# EAGLE design femtoduinoUSB (EAGLE 6.4)
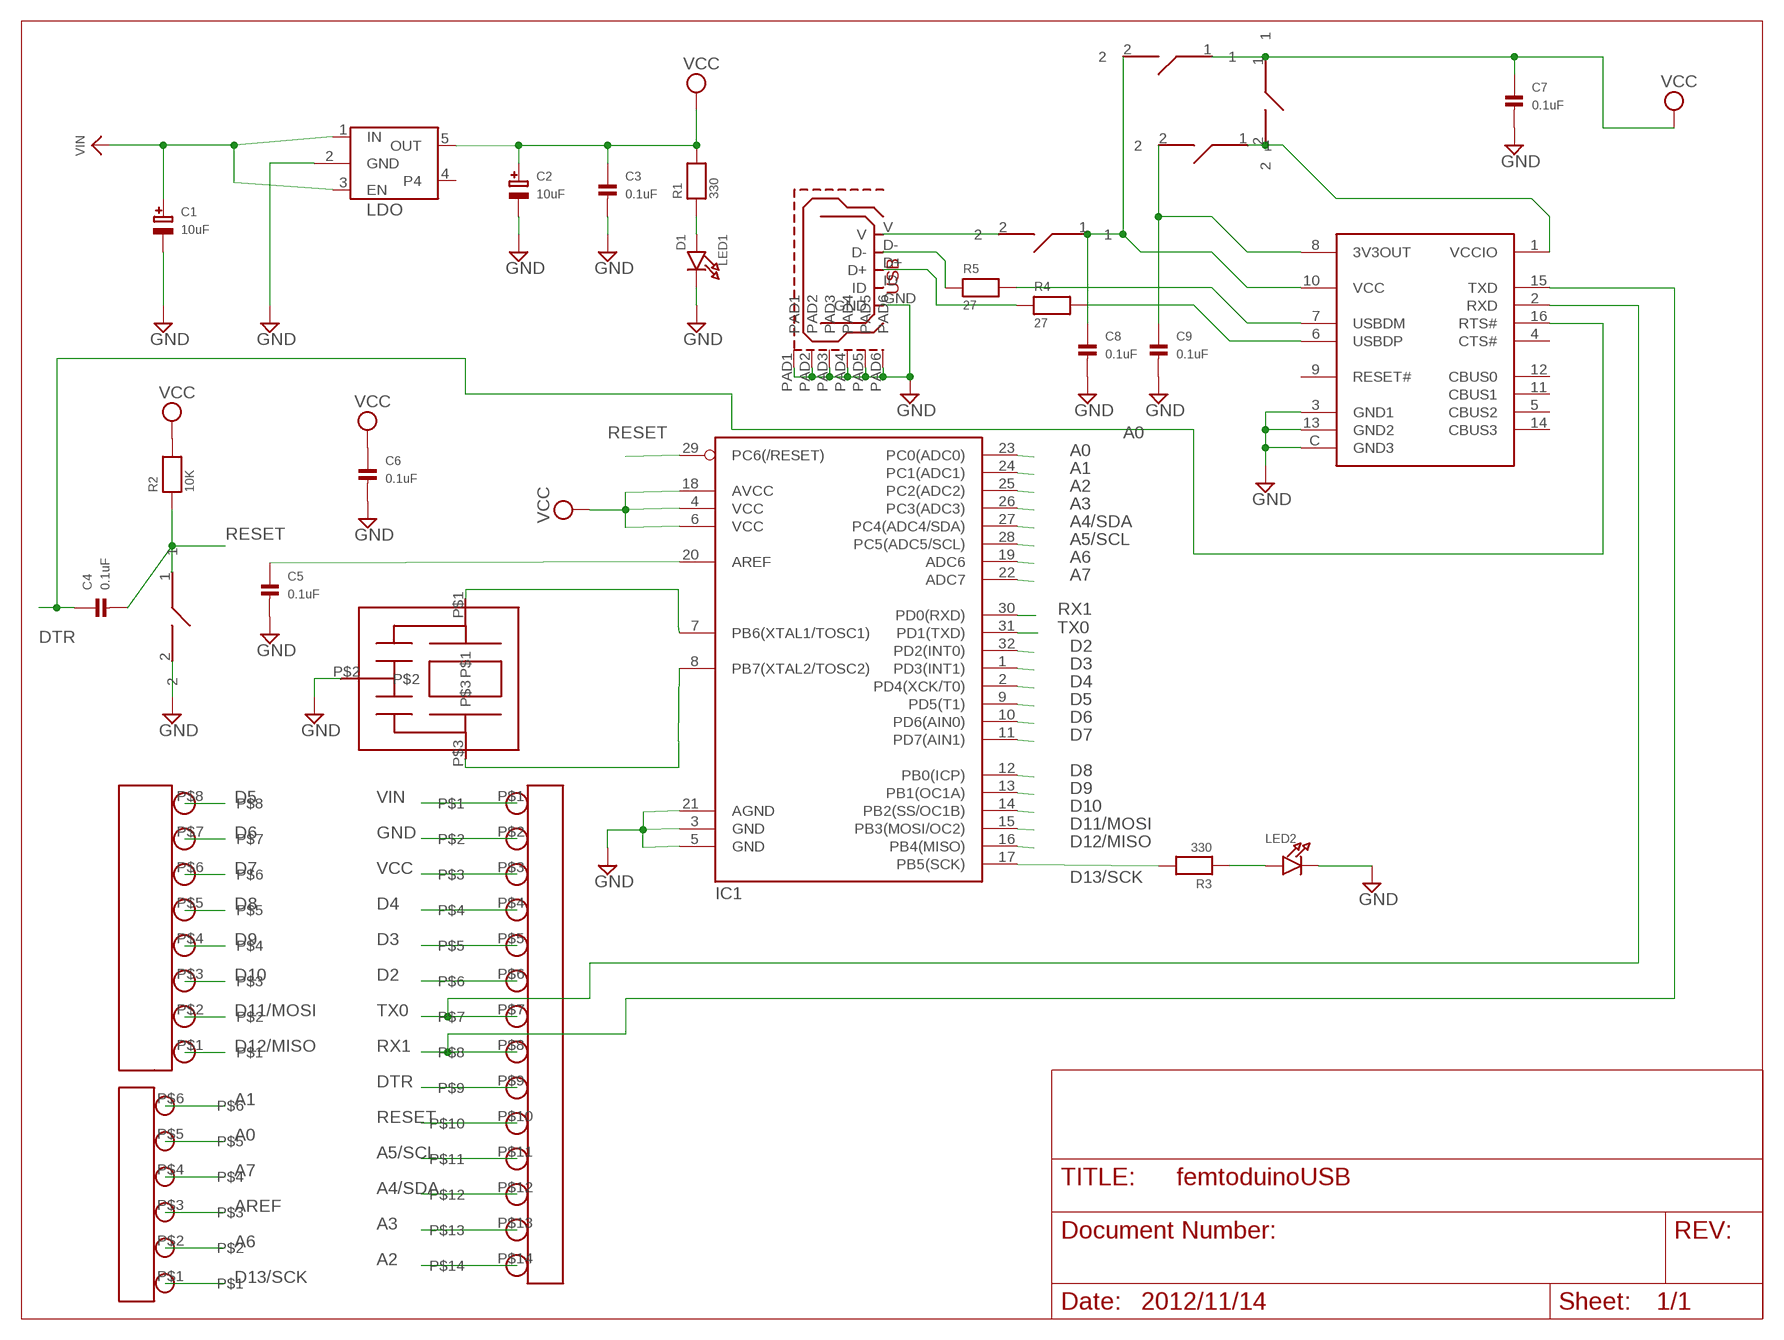
[diagram p0: schematic, sheet 1]
FRAME1 (LETTER_L): LAST_DATE_TIME: 2012/11/14

## Parts
C1  10uF  CAP_TANTALUMB/3528_WAVE  [EIA3528-21/B-W]
C2  10uF  CAP_TANTALUMB/3528_WAVE  [EIA3528-21/B-W]
C3  0.1uF  CAP_CERAMIC0402  [0402]
C4  0.1uF  CAP_CERAMIC0402  [0402]
C5  0.1uF  CAP_CERAMIC0402  [0402]
C6  0.1uF  CAP_CERAMIC0402  [0402]
C7  0.1uF  CAP_CERAMIC0402  [0402]
C8  0.1uF  CAP_CERAMIC0402  [0402]
C9  0.1uF  CAP_CERAMIC0402  [0402]
IC1  ATMEGA168MLF  [MLF32]
LED1  D1  LED0805  [CHIPLED_0805]
LED2  LED0805  [CHIPLED_0805]
R1  330  RESISTOR0402  [0402]
R2  10K  RESISTOR0402  [0402]
R3  330  RESISTOR0402  [0402]
R4  27  RESISTOR0402  [0402]
R5  27  RESISTOR0402  [0402]
SJ1  SPST_SMD  [SPST_SMD]
SJ2  SPST_SMD  [SPST_SMD]
SJ3  SPST_SMD  [SPST_SMD]
SJ4  SPST_SMD  [SPST_SMD]
U1  MIC5205  LDO_REGULATOR  [LDO_REGULATOR]
U$2  05_PINHEAD_1X6  [05_PINHEAD_1X6_PACKAGE]
U$3  05_PINHEAD_1X8  [05_PINHEAD_1X8_PACKAGE]
U$4  05_PINHEAD_1X14  [05_PINHEAD_1X14_PACKAGE]
U$5  CSTCE16MOV51-RO  [CSTCE16M0V51-RO_PACKAGE]
U$6  SPST_SMD  [SPST_SMD]
U$7  FT230XQ  [FT230XQ]
USB1  USB_MICROB  [USB_MICROB_PACKAGE]

## Nets
3V3OUT: C9.1 SJ4.2 U$7.8(3V3OUT)
A0: IC1.23(PC0(ADC0)) U$2.P$5
A1: IC1.24(PC1(ADC1)) U$2.P$6
A2: IC1.25(PC2(ADC2)) U$4.P$14
A3: IC1.26(PC3(ADC3)) U$4.P$13
A4/SDA: IC1.27(PC4(ADC4/SDA)) U$4.P$12
A5/SCL: IC1.28(PC5(ADC5/SCL)) U$4.P$11
A6: IC1.19(ADC6) U$2.P$2
A7: IC1.22(ADC7) U$2.P$4
AREF: C5.1 IC1.20(AREF) U$2.P$3
D2: IC1.32(PD2(INT0)) U$4.P$6
D3: IC1.1(PD3(INT1)) U$4.P$5
D4: IC1.2(PD4(XCK/T0)) U$4.P$4
D5: IC1.9(PD5(T1)) U$3.P$8
D6: IC1.10(PD6(AIN0)) U$3.P$7
D7: IC1.11(PD7(AIN1)) U$3.P$6
D8: IC1.12(PB0(ICP)) U$3.P$5
D9: IC1.13(PB1(OC1A)) U$3.P$4
D10: IC1.14(PB2(SS/OC1B)) U$3.P$3
D11/MOSI: IC1.15(PB3(MOSI/OC2)) U$3.P$2
D12/MISO: IC1.16(PB4(MISO)) U$3.P$1
D13/SCK: IC1.17(PB5(SCK)) R3.2 U$2.P$1
D+: R4.2 U$7.6(USBDP)
D-: R5.2 U$7.7(USBDM)
DTR: C4.1 U$4.P$9 U$7.16(RTS#)
GND: C1.- C2.- C3.2 C5.2 C6.2 C7.2 C8.2 C9.2 IC1.3(GND) IC1.5(GND) IC1.21(AGND) LED1.C LED2.C U1.2(GND) U$4.P$2 U$5.P$2 U$6.2 U$7.3(GND1) U$7.13(GND2) U$7.C(GND3) USB1.GND USB1.PAD1 USB1.PAD2 USB1.PAD3 USB1.PAD4 USB1.PAD5 USB1.PAD6
N$1: R4.1 USB1.D+
N$2: R5.1 USB1.D-
N$5: LED1.A R1.1
N$25: LED2.A R3.1
PB6: IC1.7(PB6(XTAL1/TOSC1)) U$5.P$1
PB7: IC1.8(PB7(XTAL2/TOSC2)) U$5.P$3
RESET: C4.2 IC1.29(PC6(/RESET)) R2.1 U$4.P$10 U$6.1
RX1: IC1.30(PD0(RXD)) U$4.P$8 U$7.15(TXD)
TX0: IC1.31(PD1(TXD)) U$4.P$7 U$7.2(RXD)
V_VCC: C8.1 SJ1.1 SJ2.2 U$7.10(VCC)
VCC: C2.+ C3.1 C6.1 C7.1 IC1.4(VCC) IC1.6(VCC) IC1.18(AVCC) R1.2 R2.2 SJ1.2 SJ2.1 SJ3.1 U1.5(OUT) U$4.P$3 USB1.V
VCCIO: SJ3.2 SJ4.1 U$7.1(VCCIO)
VIN: C1.+ U1.1(IN) U1.3(EN) U$4.P$1
Unconnected: U1.4 U$7.4(CTS#) U$7.5(CBUS2) U$7.9(RESET#) U$7.11(CBUS1) U$7.12(CBUS0) U$7.14(CBUS3) USB1.ID

## Library data of the parts
C1 C2 = microbuilder:CAP_TANTALUM: Tantalum Capacitors Wave footprints have larger pads and are meant to be used for hand soldering. Reflow footprints are optimised for solder paste and a reflow oven. EIA3216-18/A-[R/W] - Size A / 3216-18 / 1206 footprint 4.7µF 25V 10% Tantalum Capacitor 10µF 16V 10% Tantalum Capacitor [Digikey: 495-2236-2-ND] EIA3528-21/B-[R/W] - Size B / 3528-21 47µF 10V 10% Tantalum Capactior [Digikey: 495-2216-1-ND] EIA6032-28/C-[R/W] - Size C / 6032-28 10µF 35V 20% Tantalum Capacitor [Digikey: 495-2285-1-ND] 100µF 16V 10% Tantalum Capactior [Digikey: 399-5214-1-ND]
C3-C9 = microbuilder:CAP_CERAMIC: Ceramic Capacitors 0402 - 0402 Surface Mount Capacitors 16pF 50V 5% [Digikey: 445-4899-2-ND] 18pF 50V 5% [Digikey: 490-1281-2-ND] 22pF 50V 5% [Digikey: 490-1283-2-ND] 68pF 50V 5% [Digikey: 490-1289-2-ND] 0.1uF 10V 10% [Digikey: 490-1318-2-ND] 1.0uF 6.3V 10% [Digikey: 490-1320-2-ND] 0603 - 0603 Surface Mount Capacitors 16 pF 50V 5% [Digikey: 445-5051-2-ND] 22 pF 50V [Digikey: PCC220ACVTR-ND] 33 pF 50V 5% [Digikey: 490-1415-1-ND] 56pF 50V 5% [Digikey: 490-1421-1-ND] 220pF 50V 5% [Digikey: 445-1285-1-ND] 680 pF 50V 2200 pF 50V 5% C0G [Digikey: 445-1297-1-ND] 5600 pF 100V 5% X7R [Digikey: 478-3711-1-ND] 0.1 µF 25V 10% [Digikey: PCC2277TR-ND] 0.22 µF 16V 10% X7R [Digikey: 445-1318-1-ND] 1.0 µF 25V 10% [Digikey: 445-5146-2-ND] 0603 - RF Specific 3pF 250V +/-0.1pF RF [Digikey: 712-1347-1-ND] 18 pF 250V 5% [Digikey: 478-3505-1-ND or 712-1322-1-ND] 56 pF 250V 5% C0G RF [Digikey: 490-4867-1-ND] 68 pF 250V RF [Digikey: 490-4868-1-ND] 0805 - 0805 Surface Mount Capacitors 220 pF 250V 2% RF Ceramic Capacitor [Digikey: 712-1398-1-ND] 1000 pF 50V 2% NP0 Ceramic Capacitor [Digikey: 478-3760-1-ND] 0.1 µF 25V 10% Ceramic Capacitor [Digikey: PCC1828TR-ND] 1.0 µF 16V 10% Ceramic Capacitor[Digikey: 490-1691-2-ND] 10.0 µF 10V 10% Ceramic Capacitor[Digikey: 709-1228-1-ND] 10.0 uF 16V 10% Ceramic Capacitor [Digikey: 478-5165-2-ND] 47 uF 6.3V 20% Ceramic Capacitor [Digikey: 587-1779-1-ND or 399-5506-1-ND] 1206 - 1206 Surface Mount Capacitors 47uF 10V 20% Ceramic Capacitor [Digikey: 490-5528-1-ND or 399-5508-1-ND or 445-6010-1-ND] 100uF 6.3V -20%, +80% Y5V Ceramic Capacitor (Digikey: 490-4512-1-ND, Mouser: 81-GRM31CF50J107ZE1L)
IC1 = SparkFun-DigitalIC:ATMEGA168: Atmel 32-pin 8-bit micro, 16k flash.
LED1 LED2 = microbuilder:LED: LED 0603 - 0603 Surface Mount Package 2mA: Green LED - Low Power (3.9mcd, 2ma, 1.7Vf) - Digikey: 475-2709-2-ND Orange LED - Low Power (9.8mcd, 2ma, 1.8Vf) - Digikey: 475-1194-2-ND Red LED - Low Power (5mcd, 2ma, 1.8Vf) - Digikey: 475-1195-2-ND Yellow LED - Low Power (7mcd, 2ma, 1.8Vf) - Digikey: 475-1196-2-ND 5mA: Blue LED - Low Power (17mcd, 5ma, 2.9Vf) - Digikey: LNJ937W8CRACT-ND 0805 - 0805 Surface Mount Package 2mA: Red LED (8.8mcd, 2mA, 1.8Vf, Clear) - Low Power [Digikey: 475-2510-1-ND] Green LED (5mcd, 2mA, 1.8Vf, Clear) - Low Power [Digikey: 475-2730-1-ND] Yellow LED (11.3mcd, 2mA, 1.8Vf, Clear) - Low Power [Digikey: 475-2555-1-ND] 20mA: Red LED (104mcd, 20mA, Diffused) - LS R976 [Digikey: 475-1278-6-ND] Red LED (12mcd, 20mA, 2.0Vf, Clear) - APT2012EC [Digikey: 754-1128-1-ND] Green LED (15mcd, 20mA, 2.2Vf, Clear) - APT2012GC [Digikey: 754-1131-1-ND] Orange LED (160mcd, 20mA, 2.1Vf, Clear) - APT2012SECK [Digikey: 754-1130-1-ND] 1206 - 1206 Surface Mount Package Green LED (26mcd, 20mA, Diffused) - LG N971 [Digikey: 475-1407-6-ND] Red LED (15mcd, 20mA, Diffused) - LH N974 [Digikey: 475-1416-6-ND]
R1-R5 = microbuilder:RESISTOR: Resistors 0402 - 0402 Surface Mount Package 22 Ohm 1% 1/16W [Digikey: 311-22.0LRTR-ND] 33 Ohm 5% 1/16W 1.0K 5% 1/16W 1.5K 5% 1/16W 2.0K 1% 1/16W 10.0K 1% 1/16W [Digikey: 311-10.0KLRTR-ND] 10.0K 5% 1/16W [Digikey: RMCF0402JT10K0TR-ND] 12.1K 1% 1/16W [Digikey: 311-22.0LRTR-ND] 100.0K 5% 1/16W 0603 - 0603 Surface Mount Package 0 Ohm 1/10 Watt 1% Resistor 15 Ohm 1/10 Watt 1% Resistor 33 Ohm 1/10 Watt 1% Resistor 49.9 Ohm 1/10 Watt 1% Resistor 100 Ohm 1/10 Watt 1% Resistor 150 Ohm 1/10 Watt 1% Resistor 240 Ohm 1/10 Watt 1% Resistor 390 Ohm 1/10 Watt 1% Resistor 560 Ohm 1/10 Watt 1% Resistor 680 Ohm 1/10 Watt 1% Resistor 750 Ohm 1/10 Watt 1% Resistor 1.0K Ohm 1/10 Watt 1% Resistor 1.5K Ohm 1/10 Watt 1% Resistor 2.0K Ohm 1/10 Watt 1% Resistor 2.2K Ohm 1/10 Watt 1% Resistor 3.3K Ohm 1/10 Watt 1% Resistor 4.7K Ohm 1/10 Watt 1% Resistor 10.0K Ohm 1/10 Watt 1% Resistor 12.0K Ohm 1/10 Watt 1% Resistor 12.1K Ohm 1/10 Watt 1% Resistor 20.0K Ohm 1/10 Watt 1% Resistor 33.0K Ohm 1/10 Watt 1% Resistor 100.0K Ohm 1/10 Watt 1% Resistor 0805 - 0805 Surface Mount Package 0 Ohm 1/8 Watt 1% Resistor 33 Ohm 1/8 Watt 1% Resistor 100 Ohm 1/8 Watt 1% Resistor 150 Ohm 1/8 Watt 1% Resistor 200 Ohm 1/8 Watt 1% Resistor 240 Ohm 1/8 Watt 1% Resistor 330 Ohm 1/8 Watt 1% Resistor 390 Ohm 1/8 Watt 1% Resistor 470 Ohm 1/8 Watt 1% Resistor 1.0K Ohm 1/8 Watt 1% Resistor 1.5K Ohm 1/8 Watt 1% Resistor 2.0K Ohm 1/8 Watt 1% Resistor 4.7K Ohm 1/8 Watt 1% Resistor 5.1K Ohm 1/8 Watt 1% Resistor 5.6K Ohm 1/8 Watt 1% Resistor 10.0K Ohm 1/8 Watt 1% Resistor 22.0K Ohm 1/8 Watt 1% Resistor 33.0K Ohm 1/8 Watt 1% Resistor 100K Ohm 1/8 Watt 1% Resistor 1206 - 1206 Surface Mount Package 2012 - 2010 Surface Mount Package 0.11 Ohm 1/2 Watt 1% Resistor - Digikey: RHM.11UCT-ND
SJ1-SJ4 U$6 = ftdi_ft231xq-r:SPST_SMD
U1 = ftdi_ft231xq-r:LDO_REGULATOR
U$2 = ftdi_ft231xq-r:05_PINHEAD_1X6
U$3 = ftdi_ft231xq-r:05_PINHEAD_1X8
U$4 = ftdi_ft231xq-r:05_PINHEAD_1X14
U$5 = ftdi_ft231xq-r:CSTCE16MOV51-RO: This is the CSTCE16M0V51-R0 Murata resonator (CERALOCK) 16Mhz 0.5% Tolerance
U$7 = ftdi_ft231xq-r:FT230XQ
USB1 = ftdi_ft231xq-r:USB_MICROB: This is the hirose ZX62-B-5PA(11) MICRO-USB B Type female connection.

## Board
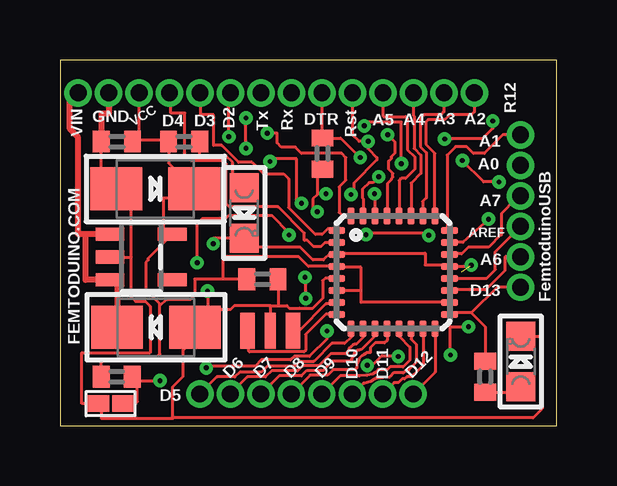
[diagram p1: board, top side]
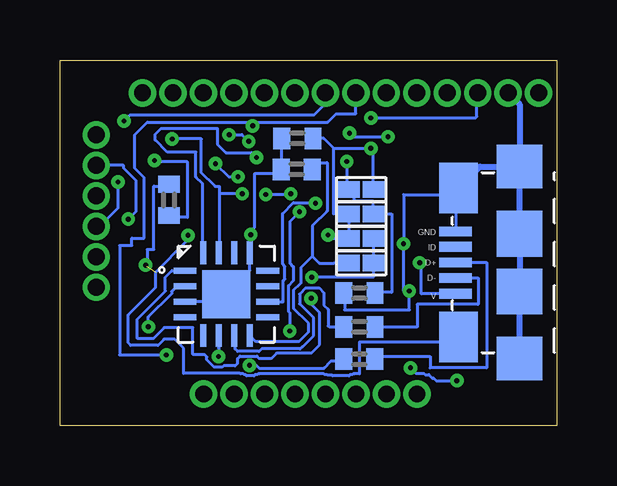
[diagram p2: board, bottom side, seen from below]

Size 20.7 x 15.24 mm. Coordinates in mm from the lower left corner, seen from the top.
Outline: 0,0 20.7,0 20.7,15.24 0,15.24 0,0
Copper layers (1*16): Top 0.0356mm / dielectric 1.5011mm / Bottom 0.0356mm
Design rules "LaenPCBOrder": minimum track width 6mil, minimum drill 13mil, track to track 6mil, track to pad 6mil, pad to pad 6mil, via to via 6mil, smd to smd 6mil, copper to edge 15mil, drill to drill 6mil, minimum pad ring 7mil, minimum via ring 7mil, stop-mask expansion 4mil, vias tented up to drill 0mil, thermal gap 10mil

### Footprints (pad centres in the part's own frame; a part is rotated, then mirrored left to right if it is on the bottom)
EIA3528-21/B-W = smd 2.15 x 1.8: + 1.625,0; - -1.625,0
0402 = smd 0.7 x 0.9: 1 -0.65,0; 2 0.65,0
MLF32 = smd 0.7 x 0.3: 1 -2.35,1.75; 2 -2.35,1.25; 3 -2.35,0.75; 4 -2.35,0.25; 5 -2.35,-0.25; 6 -2.35,-0.75; 7 -2.35,-1.25; 8 -2.35,-1.75; 17 2.35,-1.75; 18 2.35,-1.25; 19 2.35,-0.75; 20 2.35,-0.25; 21 2.35,0.25; 22 2.35,0.75; 23 2.35,1.25; 24 2.35,1.75 | smd 0.3 x 0.7: 9 -1.75,-2.35; 10 -1.25,-2.35; 11 -0.75,-2.35; 12 -0.25,-2.35; 13 0.25,-2.35; 14 0.75,-2.35; 15 1.25,-2.35; 16 1.75,-2.35; 25 1.75,2.35; 26 1.25,2.35; 27 0.75,2.35; 28 0.25,2.35; 29 -0.25,2.35; 30 -0.75,2.35; 31 -1.25,2.35; 32 -1.75,2.35
CHIPLED_0805 = smd 1.2 x 1.2: A 0,-1.05; C 0,1.05
SPST_SMD = smd 0.889 x 0.699: 1 -0.508,0; 2 0.508,0
LDO_REGULATOR = smd 0.55 x 1.2: 1 -0.95,-1.3; 2 0,-1.3; 3 0.95,-1.3; 4 0.95,1.3; 5 -0.95,1.3
05_PINHEAD_1X6_PACKAGE = drill 0.7 pad 1.143: P$1 0,0; P$2 0,1.27; P$3 0,2.54; P$4 0,3.81; P$5 0,5.08; P$6 0,6.35
05_PINHEAD_1X8_PACKAGE = drill 0.7 pad 1.143: P$1 0,0; P$2 0,1.27; P$3 0,2.54; P$4 0,3.81; P$5 0,5.08; P$6 0,6.35; P$7 0,7.62; P$8 0,8.89
05_PINHEAD_1X14_PACKAGE = drill 0.7 pad 1.143: P$1 0,0; P$2 0,1.27; P$3 0,2.54; P$4 0,3.81; P$5 0,5.08; P$6 0,6.35; P$7 0,7.62; P$8 0,8.89; P$9 0,10.16; P$10 0,11.43; P$11 0,12.7; P$12 0,13.97; P$13 0,15.24; P$14 0,16.51
CSTCE16M0V51-RO_PACKAGE = smd 1.5 x 0.62: P$1 0,1.9; P$3 0,0 | smd 1.5 x 0.45: P$2 0,0.95
FT230XQ = smd 0.95 x 0.25: 1 -1.725,0.975; 2 -1.725,0.325; 3 -1.725,-0.325; 4 -1.725,-0.975; 9 1.725,-0.975; 10 1.725,-0.325; 11 1.725,0.325; 12 1.725,0.975 | smd 0.25 x 0.95: 5 -0.975,-1.725; 6 -0.325,-1.725; 7 0.325,-1.725; 8 0.975,-1.725; 13 0.975,1.725; 14 0.325,1.725; 15 -0.325,1.725; 16 -0.975,1.725 | smd 2 x 2: C 0,0
USB_MICROB_PACKAGE = smd 0.4 x 1.35: D+ 0,-0.68; D- -0.64,-0.68; GND 1.3,-0.68; ID 0.66,-0.68; V -1.3,-0.68 | smd 2.1 x 1.6: PAD1 -3.1,-0.8; PAD2 3.1,-0.8 | smd 1.8 x 1.9: PAD3 -4,-3.35; PAD6 4,-3.35 | smd 1.9 x 1.9: PAD4 -1.2,-3.35; PAD5 1.2,-3.35

### Placement (x,y rotation side)
C1  4,4.1 180 top
C2  3.97,9.87 0 top
C3  2.37,11.84 180 top
C4  10.93,11.34 270 top
C5  16.16,9.41 90 bottom
C6  8.44,6.11 0 top
C7  10.81,11.98 180 bottom
C8  8.22,5.53 180 bottom
C9  10.84,10.68 180 bottom
IC1  13.88,6.39 0 top
LED1  7.67,8.87 180 top
LED2  19.2,2.68 0 top
R1  5.17,11.84 180 top
R2  2.36,2.04 180 top
R3  17.72,2.04 90 top
R4  8.23,2.78 180 bottom
R5  8.22,4.12 180 bottom
SJ1  8.15,9.85 0 bottom
SJ2  8.15,8.82 0 bottom
SJ3  8.15,7.8 0 bottom
SJ4  8.15,6.79 180 bottom
U1  3.38,7.03 270 top
U$2  19.19,5.77 0 top
U$3  14.72,1.32 90 top
U$4  0.76,13.87 270 top
U$5  7.81,3.97 270 top
U$6  2.11,0.92 180 top
U$7  13.77,5.49 0 bottom
USB1  4.9,6.8 90 bottom

### Tracks (layer width: path | path; a pad name or v marks a point on that pad's centre or on a via)
3V3OUT
  Bottom 0.127: C9.1 10.24,10.96 9.58,10.96 9.58,8.94 10.19,8.33 10.19,7.07 | SJ4.2 9.28,6.77 9.89,6.77 10.19,7.07 | 10.19,7.07 10.67,6.58 10.67,5.94 10.97,5.64 10.97,4.9 10.34,4.27 10.34,3.91 10.74,3.5 12.54,3.5 U$7.8
A0  (via drill 0.2)
  Top 0.127: v17.86,8.61 16.79,7.64 IC1.23
  Bottom 0.127: U$2.P$5 18.06,10.85 18.06,10.75 17.55,10.24 17.55,8.91 v17.86,8.61
A1
  Top 0.127: U$2.P$6 18.45,12.12 17.68,11.35 17.22,11.35 16.94,11.63 16.48,11.63 16.13,11.28 16.13,8.24 IC1.24
A2
  Top 0.127: U$4.P$14 17.27,13.07 17.14,12.95 16.23,12.95 16.03,12.75 15.34,12.75 15.24,12.65 15.24,11.73 15.62,11.35 IC1.25
A3
  Top 0.127: U$4.P$13 16,13.07 15.88,12.95 15.16,12.95 15.01,12.8 15.01,11.63 15.27,11.38 15.27,9.5 15.11,9.35 15.11,8.76 IC1.26
A4/SDA
  Top 0.127: U$4.P$12 14.73,12.94 14.76,12.9 14.76,11.56 15.04,11.28 15.04,10.52 14.63,10.11 IC1.27
A5/SCL
  Top 0.127: U$4.P$11 13.46,12.91 13.49,12.88 14.4,12.88 14.48,12.8 14.48,11.51 14.78,11.2 14.78,10.69 14.4,10.31 14.22,10.31 14.13,10.22 IC1.28
A6
  Top 0.127: U$2.P$2 18.55,7.04 18.54,7.04 18.54,6.48 17.73,5.66 16.25,5.66 IC1.19
A7
  Top 0.127: U$2.P$4 18.98,9.58 18.98,9.43 18.39,8.84 18.39,7.95 18.36,7.95 17.86,7.44 17.02,7.44 16.74,7.16 16.25,7.16 IC1.22
AREF  (via drill 0.2)
  Top 0.127: v18.29,10.16 17.65,10.16 v16.76,11.05 | IC1.20 17.78,6.14 18.14,6.5 18.14,7.26 U$2.P$3
  Bottom 0.127: v16.76,11.05 16.76,11 15.39,11 15.39,8.69 16.16,8.69 C5.1 | U$2.P$3 19.05,8.31 18.29,9.07 v18.29,10.16
D2  (via drill 0.2)
  Top 0.127: v8.64,12.19 9.04,12.19 9.04,11.79 9.22,11.61 9.8,11.61 10.06,11.35 11.73,11.35 11.91,11.18 11.91,10.24 11.63,9.96 11.63,8.89 11.78,8.74 IC1.32 | v7.04,12.04 7.04,13.8 U$4.P$6
  Bottom 0.127: v8.64,12.19 8.48,12.04 v7.04,12.04
D3
  Top 0.127: U$4.P$5 5.84,12.95 6.4,12.95 6.4,11.68 6.73,11.68 7.44,10.97 8,10.97 8.48,10.49 9.32,10.49 9.53,10.29 9.53,9.09 10.64,7.98 10.92,7.98 11.15,8.21 11.53,8.21 IC1.1
D4
  Top 0.127: U$4.P$4 4.62,13.87 4.62,13.03 5.21,13.03 5.21,11.3 5.46,11.05 6.78,11.05 6.93,10.9 6.93,9.25 7.06,9.12 9.09,9.12 10.19,8.03 10.19,7.72 10.31,7.72 10.57,7.47 10.87,7.47 11.02,7.62 11.21,7.62 11.23,7.64 IC1.2
D5
  Top 0.127: U$3.P$8 6.54,2.03 7.29,2.03 7.49,2.23 8.38,2.23 8.64,2.49 9.78,2.49 9.98,2.69 10.59,2.69 11.33,3.43 11.86,3.43 12.13,3.7 IC1.9
D6
  Top 0.127: U$3.P$7 7.81,2.03 8.56,2.03 8.81,2.29 9.91,2.29 10.13,2.52 10.79,2.52 11.28,3 11.94,3 11.96,3.02 11.96,3.07 12.01,3.12 12.01,3.15 12.04,3.17 12.04,3.23 12.12,3.3 12.14,3.3 12.22,3.38 12.24,3.38 12.27,3.4 12.34,3.4 12.63,3.69 IC1.10
D7
  Top 0.127: U$3.P$6 9.13,2.08 10.06,2.08 10.29,2.31 10.97,2.31 11.35,2.69 12.09,2.69 12.17,2.77 12.17,2.82 12.22,2.87 12.22,2.92 12.24,2.95 12.24,3 12.27,3.02 12.27,3.05 12.34,3.12 12.37,3.12 12.39,3.15 12.47,3.15 12.5,3.17 12.55,3.17 13.13,3.76 IC1.11
D8
  Top 0.127: U$3.P$5 10.42,2.11 11.15,2.11 11.38,2.34 12.29,2.34 12.37,2.41 12.37,2.49 12.37,2.59 12.42,2.69 12.45,2.72 12.45,2.77 12.47,2.79 12.47,2.82 12.57,2.92 12.6,2.92 12.62,2.95 12.65,2.95 12.7,3 12.72,3 12.78,3.05 12.93,3.05 12.93,3.25 13.13,3.45 13.51,3.45 13.63,3.57 IC1.12
D9
  Top 0.127: U$3.P$4 11.67,2.08 12.47,2.08 12.79,2.1 13,2.15 13.11,2.21 13.23,2.31 13.26,2.34 13.64,2.34 13.75,2.45 14.3,2.45 14.58,2.73 14.58,3.28 14.13,3.73 IC1.13
D10
  Top 0.127: IC1.14 14.63,3.61 14.83,3.4 14.83,2.64 14.53,2.34 14.53,2.33 14.5,2.3 14.4,2.3 14.3,2.2 13.9,2.2 13.75,2.05 13.2,2 12.98,1.88 12.64,1.78 U$3.P$3
D11/MOSI
  Top 0.127: IC1.15 15.13,2.53 14.73,2.13 14.65,2.05 14.45,2.05 14.35,1.95 14.25,1.95 14.1,1.8 13.93,1.8 U$3.P$2
D12/MISO
  Top 0.127: IC1.16 15.63,2.23 U$3.P$1
D13/SCK
  Top 0.127: U$2.P$1 18.22,5.77 17.14,4.7 | 17.14,4.7 16.29,4.7 IC1.17 | 17.14,4.7 17.72,4.13 R3.2
D+  (via drill 0.2)
  Top 0.127: v12.8,2.52 13.01,2.52 13.41,2.92 13.98,2.92 v14.1,2.88
  Bottom 0.127: U$7.6 14.09,3.24 v14.1,2.88 | v12.8,2.52 12.52,2.52 12.4,2.4 9.7,2.4 9.4,2.7 8.96,2.7 R4.2
D-
  Bottom 0.127: 8.94,4.19 R5.2 | 9.02,4.27 R5.2 | R5.2 9.48,4.12 9.53,4.17 9.53,4.85 9.7,5.03 9.7,5.54 9.91,5.74 10.46,5.74 10.72,5.49 10.72,5.08 10.13,4.5 10.13,3.76 10.62,3.28 10.7,3.2 12.3,3.2 12.4,3.1 13.3,3.1 13.4,3.2 13.4,3.72 U$7.7
DTR  (via drill 0.2)
  Top 0.127: 10.93,13.87 U$4.P$9 10.92,12.01 C4.1 11.7,11.99 v12.51,11.18
  Bottom 0.127: U$7.16 14.76,7 14.76,10.08 15.04,10.36 15.04,11.4 16.23,11.4 16.74,11.91 16.74,12.14 16.48,12.39 14.15,12.39 14.15,11.73 13.79,11.38 12.71,11.38 v12.51,11.18
GND  (via drill 0.2)  (1 unrouted)
  Top 0.127: 19.23,4 LED2.C 20.09,3.73 20.09,0.71 19.71,0.33 4.7,0.33 | U1.2 2.97,7.03 | 2.97,7.03 2.97,9.47 2.35,9.47 C2.- 1.72,9.87 C3.2 1.8,11.91 | C1.- 6.15,4.1 6.15,4.67 v6.15,5.61 | 11.53,7.19 IC1.3 | 2.97,7.03 2.97,5.36 3.15,5.18 3.56,5.18 3.76,4.98 3.76,3.05 0.91,3.05 0.91,0.93 U$6.2 1.73,0.93 1.73,0.3 4.7,0.3 4.7,0.33 | 7.98,8.13 LED1.C | 11.53,6.2 IC1.5 11.04,6.14 10.95,6.04 10.95,5.31 10.52,4.88 10.01,4.88 9.98,4.9 9.55,4.9 9.45,5 9.09,5 | C1.- 5.62,3.64 5.13,3.15 5.13,2.06 4.7,1.63 4.7,0.33 | 11.53,7.19 15.21,7.19 15.21,6.71 16.23,6.71 IC1.21 17.08,6.64 v17.13,6.69 | 8.76,5 U$5.P$2 | C1.- 6.38,4.85 7.11,4.85 7.26,5 8.76,5 | 8.76,5 9.09,5 | 2.03,13.03 2.01,13.01 | LED1.C 6.39,7.82 v6.39,7.58 | LED1.C 8.08,7.42 8.1,7.44 10.01,7.44 10.54,6.91 10.97,6.91 11.25,7.19 11.53,7.19 | C6.2 9.09,5 | v15.37,7.93 15.37,8.01 12.8,8.01 v12.75,7.96
  Top 0.254: U$4.P$2 2.03,13.03 | 2.01,13.01 1.73,13.01 1.73,12.52 C3.2
  Bottom 0.127: 11.64,10.64 C9.2 | C5.2 16.16,9.98 16.79,9.98 16.79,7.34 17.07,7.34 17.07,6.76 v17.13,6.69 | C8.2 8.84,5.54 8.84,4.83 6.15,4.83 v6.15,5.61 6.39,5.61 v6.39,7.58 6.39,9.63 4.1,9.63 USB1.PAD2 4.22,9.9 USB1.GND | C7.2 11.49,11.8 C9.2 | USB1.PAD1 4.32,3.48 8.23,3.48 8.23,2.16 8.48,2.16 8.51,2.13 8.61,2.13 8.66,2.08 9.35,2.08 9.37,2.11 9.55,2.11 9.58,2.13 9.68,2.13 9.7,2.16 12.45,2.16 12.47,2.13 12.57,2.13 12.62,2.08 12.93,2.08 12.98,2.13 13.03,2.13 13.06,2.16 13.18,2.16 13.21,2.18 15.54,2.18 15.54,3.23 15.93,3.61 16.36,3.61 16.61,3.35 17.75,3.35 17.86,3.45 17.86,4.62 16.71,5.77 16.71,6.4 15.43,7.68 15.43,7.93 v15.37,7.93 | U$7.3 14.09,5.16 U$7.C 12.79,6.46 U$7.13 12.79,7.95 v12.75,7.96 12.8,8.06 12.79,8.06 12.6,8.26 12.6,10.49 12.57,10.52 11.65,10.52 C9.2 | 11.49,10.33 C9.2
  Bottom 0.254: U$4.P$2 1.55,13.39 USB1.PAD6 | USB1.PAD6 USB1.PAD5 USB1.PAD4 USB1.PAD3 | USB1.PAD2 3.2,10.8 USB1.PAD6
N$1
  Bottom 0.127: USB1.D+ 2.92,6.81 2.92,2.41 5.28,2.41 5.28,2.9 7.58,2.9 R4.1 7.58,2.72
N$2
  Bottom 0.127: USB1.D- 3.28,6.16 3.28,5.05 5.82,5.05 5.82,4.12 R5.1
N$5
  Top 0.127: LED1.A 7.19,10.4 7.19,10.97 6.91,11.25 5.82,11.25 R1.1
N$25
  Top 0.127: 18.84,1.57 LED2.A 19.2,1.39 R3.1
PB6
  Top 0.127: U$5.P$1 9.93,3.97 | IC1.7 11.53,5.08 11.07,5.08 9.96,3.97 U$5.P$1 | 9.71,4.28 U$5.P$1 | 9.76,4.01 U$5.P$1
PB7
  Top 0.127: IC1.8 11.07,4.64 10.24,3.81 10.24,3.15 10.16,3.07 7.9,3.07 7.87,3.1 7.87,3.9 U$5.P$3
RESET  (via drill 0.2)
  Top 0.127: 11.18,10.69 C4.2 10.72,10.47 10.72,9.68 | U$4.P$10 12.19,12.12 12.46,11.85 v12.84,11.85 12.84,11.54 13.21,11.18 13.21,11.07 12.24,10.11 12.24,9.75 v12.13,9.64 | v6.1,2.41 6.17,2.49 8.13,2.49 8.38,2.74 9.6,2.74 9.75,2.9 10.39,2.9 11.12,3.63 v11.12,3.95 | v4.17,1.88 3.18,1.88 R2.1 3.23,1.83 3.23,1.02 3.13,0.93 U$6.1 | 13.61,8.73 IC1.29 13.65,8.77 13.65,10.1 13.82,10.26 13.82,10.31 13.87,10.36 13.87,10.52 13.69,10.69 13.69,11.02 13.79,11.12 13.79,11.2 13.95,11.35 13.95,11.84 v13.65,12.13 | v10.72,8.91 10.54,9.09 10.54,9.45 10.72,9.63 10.72,9.68 | v11.09,9.66 10.73,9.66 10.72,9.68
  Bottom 0.127: v6.1,2.41 5.87,2.18 5.54,2.18 5.49,2.13 5.33,2.13 5.18,1.98 5.13,1.98 5.03,1.88 v4.17,1.88 | v13.65,12.13 13.12,12.13 v12.84,11.85 | v11.12,3.95 11.12,4.7 11.18,4.75 11.18,5.84 10.97,6.04 10.97,6.63 11.12,6.78 11.12,8.51 v10.72,8.91 | v12.13,9.64 11.11,9.64 v11.09,9.66
RX1  (via drill 0.2)
  Top 0.127: v16.03,11.95 17.59,11.95 18.03,12.39 v18.03,12.7 | IC1.30 13.13,9.64 v13.11,9.66
  Bottom 0.127: U$4.P$8 9.65,13.42 10.11,12.95 17.78,12.95 v18.03,12.7 | U$7.15 14.05,7.03 14.05,9.66 | v16.03,11.95 14.81,11.95 14.81,10.54 14.24,9.97 14.05,9.97 14.05,9.66 | v13.11,9.66 14.05,9.66
TX0  (via drill 0.2)
  Top 0.127: v14.22,10.92 14.22,12.65 12.83,12.65 v12.68,12.5 | v16.27,2.95 16.27,4.13 v17.02,4.13 | v13.28,10.38 13.04,10.13 12.88,10.13 12.6,9.86 12.6,9.5 12.63,9.47 IC1.31
  Bottom 0.127: U$4.P$7 8.38,13.01 8.38,13 9.2,13 9.55,12.65 12.52,12.65 v12.68,12.5 12.83,12.65 17.06,12.65 17.6,12.11 17.6,10.74 17.2,10.34 17.2,7.82 17.7,7.82 17.7,7.52 18.21,7.52 18.21,2.95 v16.27,2.95 | v14.22,10.92 13.68,10.38 v13.28,10.38 | v17.02,4.13 17.02,4.53 16.05,5.5 16.05,5.6 15.99,5.66 15.98,5.66 15.83,5.81 U$7.2
V_VCC  (via drill 0.2)
  Top 0.127: v10.06,9.27 9.86,9.27 9.86,11.12 8.75,11.12 v8.75,11.01
  Bottom 0.127: v8.75,11.01 8.75,9.85 SJ1.1 8.43,9.85 8.43,9.35 7.64,9.35 SJ2.2 6.88,8.82 6.88,5.56 7.57,5.56 C8.1 | v10.06,9.27 10.08,9.3 10.97,9.3 11.43,8.84 11.43,6.73 11.33,6.63 11.33,6.12 11.41,6.04 11.41,5.16 11.6,5.16 U$7.10
VCC  (via drill 0.2)
  Top 0.127: v7.75,11.56 v7.75,12.83 | 4.75,11.91 R1.2 | C2.+ 6.15,9.87 5.41,9.13 | IC1.6 12.55,5.64 | 12.55,5.64 12.55,6.6 11.53,6.6 IC1.4 10.35,6.64 9.96,7.04 6.81,7.04 6.81,6.12 | IC1.18 12.55,5.14 12.55,5.64 | C6.1 6.81,6.11 6.81,6.12 | R1.2 4.52,10.94 C2.+ | U$4.P$3 3.3,12.19 C3.1 3.1,11.91 4.52,11.91 R1.2 | R2.2 1.71,2.65 1.8,2.74 3.91,2.74 4.17,3 4.17,5 | 4.17,5 4.17,5.08 3.58,5.66 3.58,6.81 3.68,6.91 3.68,6.98 U1.5 4.32,7.98 4.32,9.5 5.59,9.5 C2.+ | 6.81,6.12 5.61,6.12 5.61,5.44 5.44,5.26 4.42,5.26 4.17,5 | v5.71,6.79 5.71,8.41 5.94,8.64 6.91,8.64 7.04,8.76 8.83,8.76 9.54,8.05 v9.54,7.95
  Bottom 0.127: v7.75,12.83 3.38,12.83 3.33,12.88 3.33,13.84 U$4.P$3 | 9.3,11.56 v7.75,11.56 7.64,11.56 SJ1.2 | SJ3.1 SJ2.1 9.3,8.82 9.3,11.56 | USB1.V 5.64,5.5 5.64,6.72 v5.71,6.79 | 8.85,8 SJ3.1 | 9.3,11.56 9.71,11.97 C7.1 | v9.54,7.95 9.39,7.8 SJ3.1
VCCIO  (via drill 0.2)
  Top 0.127: 10.22,6.18 v10.21,6.18 10.24,6.16 v10.24,5.31
  Bottom 0.127: SJ3.2 SJ4.1 7.64,6.2 10.2,6.2 v10.21,6.18 | v10.24,5.31 10.24,5.05 9.88,4.7 9.88,3.38 10.24,3.02 11.68,3.02 11.9,2.8 12.4,2.8 12.5,2.9 13.2,2.9 13.3,2.8 13.3,2.6 13.4,2.5 13.88,2.5 13.95,2.44 14.27,2.44 14.58,2.74 14.58,2.87 14.68,2.98 15.16,2.98 15.16,4.09 16.36,4.09 16.82,3.63 17.48,3.63 17.48,4.45 16.31,5.61 16.31,6.2 16.04,6.46 U$7.1 15.66,6.46
VIN
  Top 0.127: U1.3 2.38,6.08
  Top 0.254: U1.1 1.07,7.98 | 1.07,7.98 0.76,7.98 0.76,12.02 0.41,12.37 0.41,13.52 U$4.P$1 | 2.38,6.08 C1.+ | U1.3 1.07,6.08 1.07,7.98

### Text on the board
tNames: GND | DTR | A5 | A4 | A3 | A2 | R12 | VIN | VCC | D4 | D3 | D2 | Tx | Rx | Rst | A1 | A0 | A7 | AREF | A6 | D13 | FemtoduinoUSB | FEMTODUINO.COM | D6 | D7 | D8 | D9 | D10 | D11 | D12 | D5